# EasyEDA schematic 6502-debugProbe.json
TITLE: Probe; REV: 1.0; Date: 2023-04-01; Sheet: 1/1; Drawn By: devramsean0; Company: Your Company
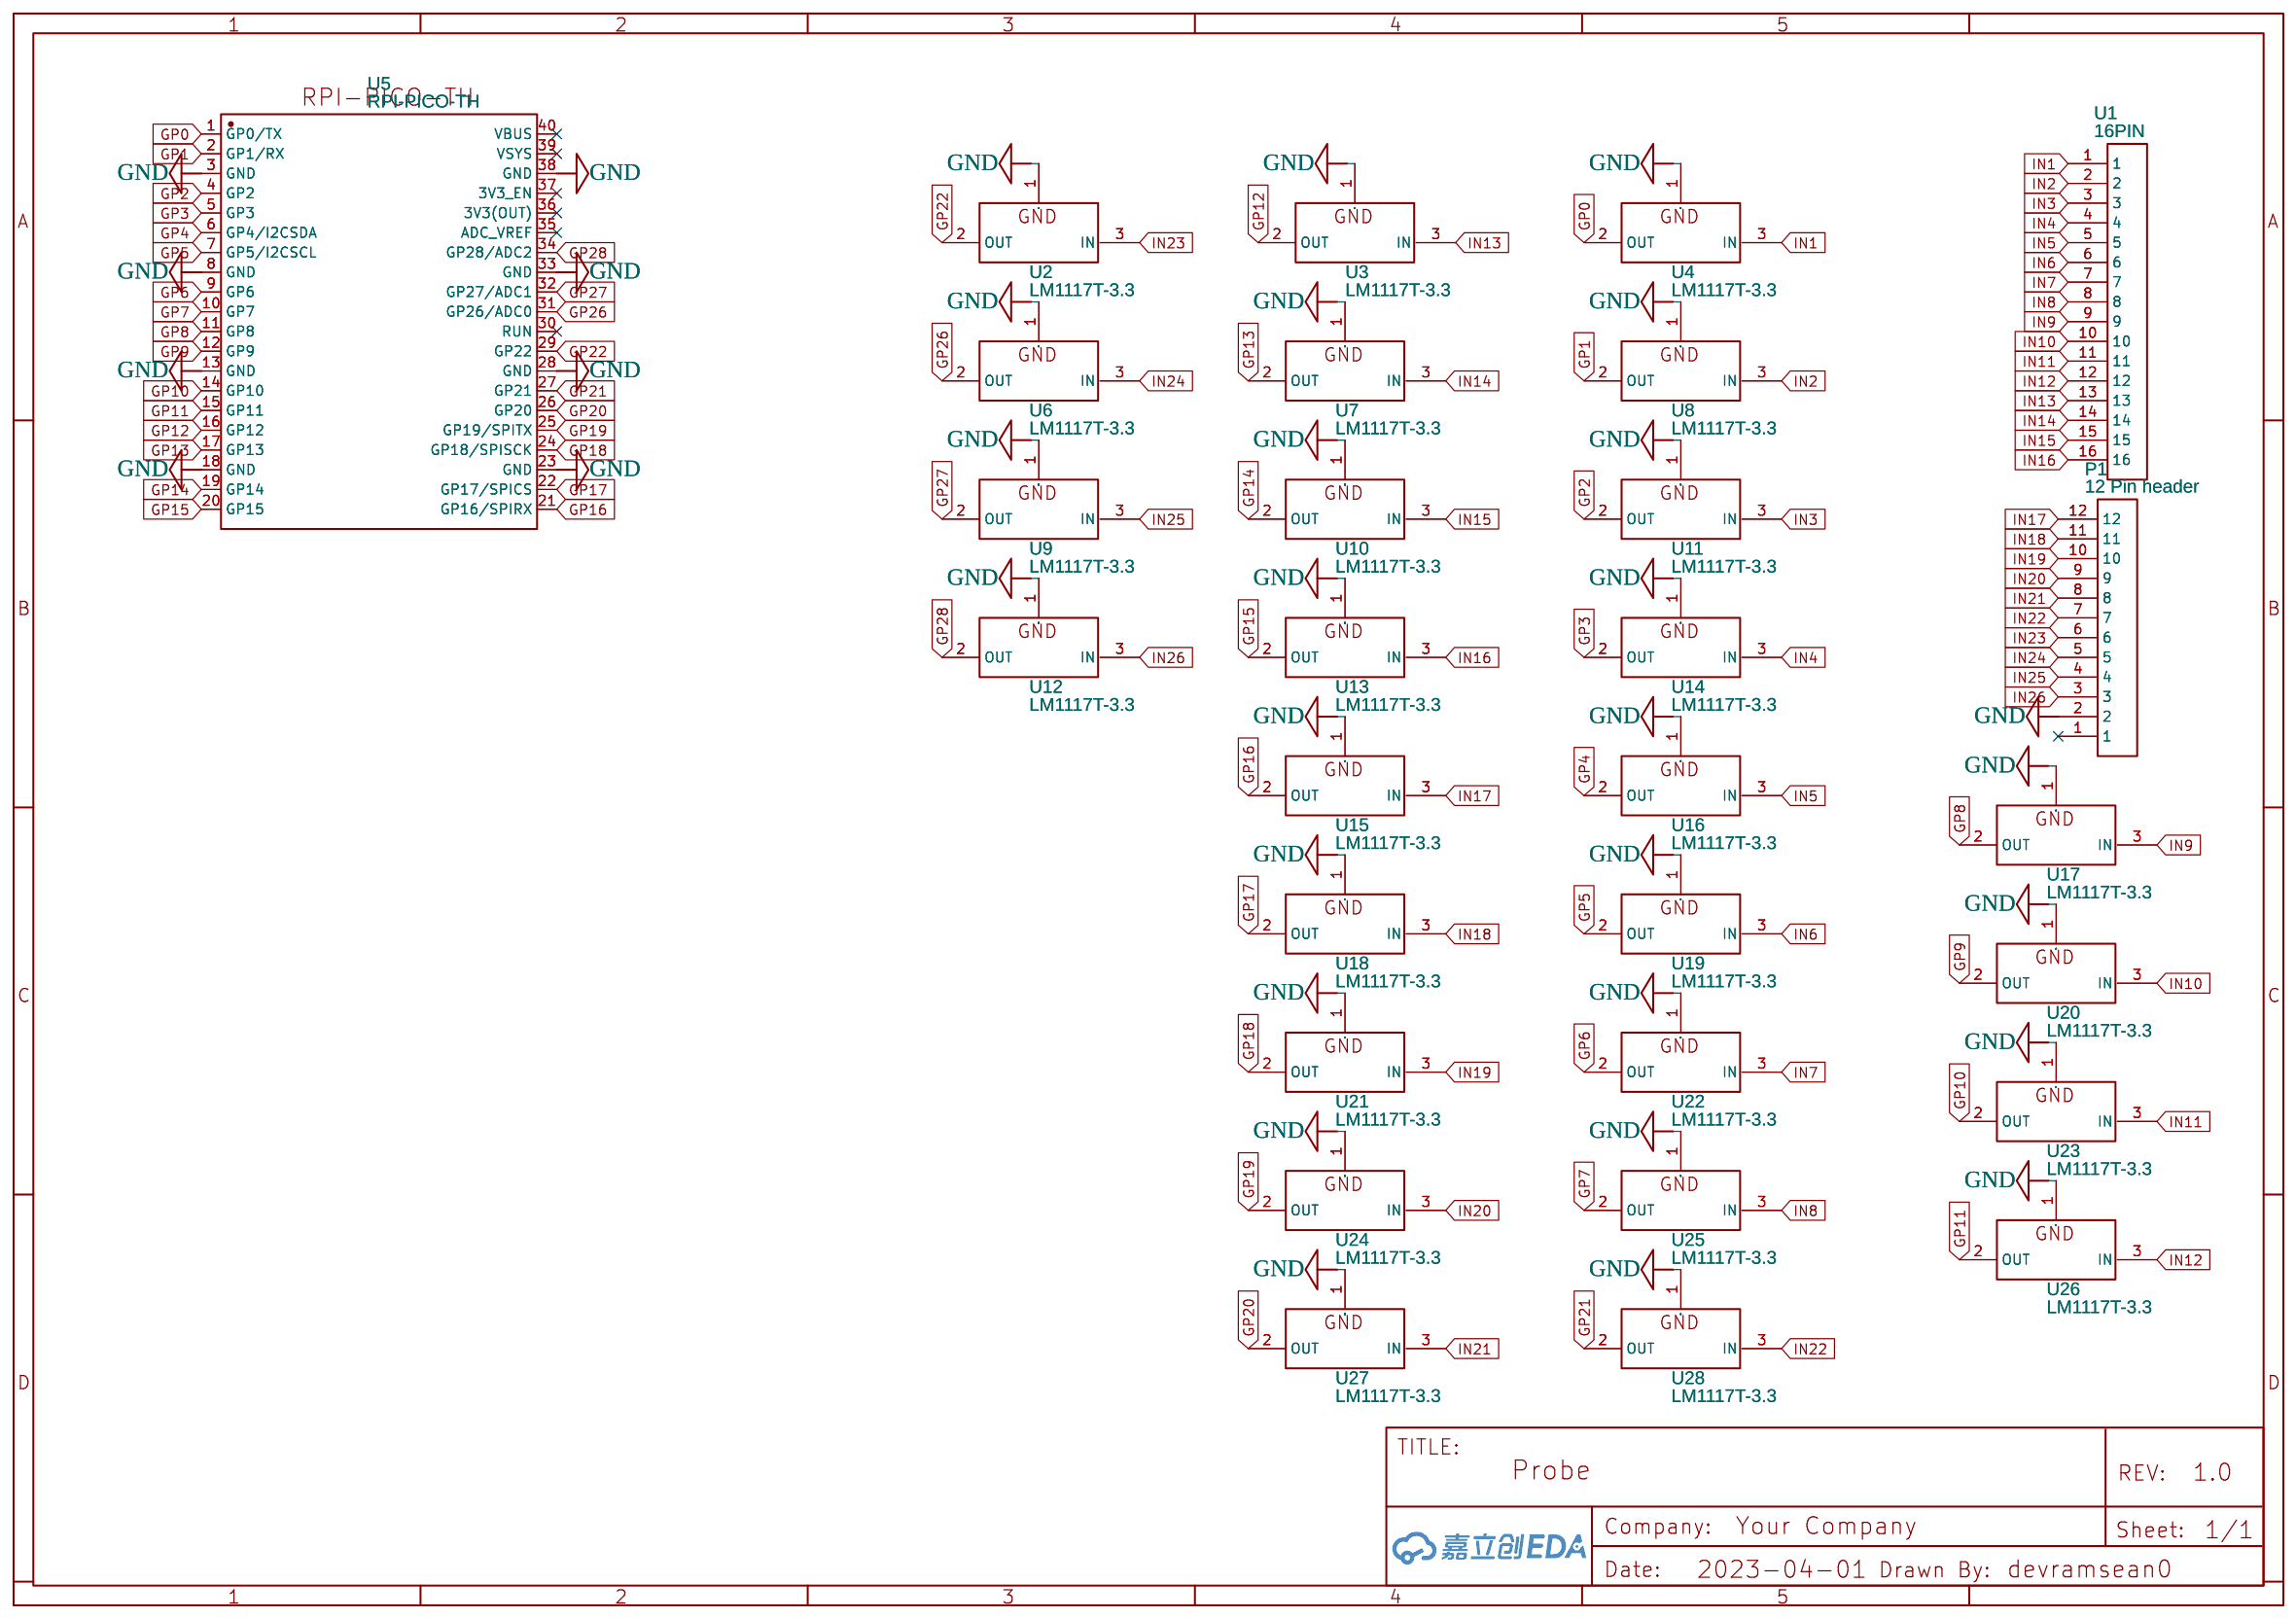
[diagram p0: schematic sheet]

## Parts
P1  12 Pin header  [12PINHEADER]
U1  16PIN  [16PIN]
U2  LM1117T-3.3  [TO-220-3_L10.0-W4.5-P2.54-L]
U3  LM1117T-3.3  [TO-220-3_L10.0-W4.5-P2.54-L]
U4  LM1117T-3.3  [TO-220-3_L10.0-W4.5-P2.54-L]
U5  RPI-PICO-TH  [RPI-PICO-TH]
U6  LM1117T-3.3  [TO-220-3_L10.0-W4.5-P2.54-L]
U7  LM1117T-3.3  [TO-220-3_L10.0-W4.5-P2.54-L]
U8  LM1117T-3.3  [TO-220-3_L10.0-W4.5-P2.54-L]
U9  LM1117T-3.3  [TO-220-3_L10.0-W4.5-P2.54-L]
U10  LM1117T-3.3  [TO-220-3_L10.0-W4.5-P2.54-L]
U11  LM1117T-3.3  [TO-220-3_L10.0-W4.5-P2.54-L]
U12  LM1117T-3.3  [TO-220-3_L10.0-W4.5-P2.54-L]
U13  LM1117T-3.3  [TO-220-3_L10.0-W4.5-P2.54-L]
U14  LM1117T-3.3  [TO-220-3_L10.0-W4.5-P2.54-L]
U15  LM1117T-3.3  [TO-220-3_L10.0-W4.5-P2.54-L]
U16  LM1117T-3.3  [TO-220-3_L10.0-W4.5-P2.54-L]
U17  LM1117T-3.3  [TO-220-3_L10.0-W4.5-P2.54-L]
U18  LM1117T-3.3  [TO-220-3_L10.0-W4.5-P2.54-L]
U19  LM1117T-3.3  [TO-220-3_L10.0-W4.5-P2.54-L]
U20  LM1117T-3.3  [TO-220-3_L10.0-W4.5-P2.54-L]
U21  LM1117T-3.3  [TO-220-3_L10.0-W4.5-P2.54-L]
U22  LM1117T-3.3  [TO-220-3_L10.0-W4.5-P2.54-L]
U23  LM1117T-3.3  [TO-220-3_L10.0-W4.5-P2.54-L]
U24  LM1117T-3.3  [TO-220-3_L10.0-W4.5-P2.54-L]
U25  LM1117T-3.3  [TO-220-3_L10.0-W4.5-P2.54-L]
U26  LM1117T-3.3  [TO-220-3_L10.0-W4.5-P2.54-L]
U27  LM1117T-3.3  [TO-220-3_L10.0-W4.5-P2.54-L]
U28  LM1117T-3.3  [TO-220-3_L10.0-W4.5-P2.54-L]

## Library data of the parts
P1 = 12 Pin header: Contributor: stefanfransen16
U1 = 16PIN: Contributor: Ostap Ostap
U2-U4 U6-U28 = LM1117T-3.3: Supplier: LCSC; Supplier Part: C498321; Manufacturer: HGSEMI; Contributor: LCSC; JLCPCB Part Class: Extended Part
U5 = RPI-PICO-TH: Manufacturer: Raspberry Pi; Manufacturer Part: RP2040; Contributor: Dddienst

## Nets
GND: P1.2 U2.1(GND) U3.1(GND) U4.1(GND) U5.3(GND) U5.8(GND) U5.13(GND) U5.18(GND) U5.23(GND) U5.28(GND) U5.33(GND) U5.38(GND) U6.1(GND) U7.1(GND) U8.1(GND) U9.1(GND) U10.1(GND) U11.1(GND) U12.1(GND) U13.1(GND) U14.1(GND) U15.1(GND) U16.1(GND) U17.1(GND) U18.1(GND) U19.1(GND) U20.1(GND) U21.1(GND) U22.1(GND) U23.1(GND) U24.1(GND) U25.1(GND) U26.1(GND) U27.1(GND) U28.1(GND)
GP0: U4.2(OUT) U5.1(GP0/TX)
GP1: U5.2(GP1/RX) U8.2(OUT)
GP2: U5.4(GP2) U11.2(OUT)
GP3: U5.5(GP3) U14.2(OUT)
GP4: U5.6(GP4/I2CSDA) U16.2(OUT)
GP5: U5.7(GP5/I2CSCL) U19.2(OUT)
GP6: U5.9(GP6) U22.2(OUT)
GP7: U5.10(GP7) U25.2(OUT)
GP8: U5.11(GP8) U17.2(OUT)
GP9: U5.12(GP9) U20.2(OUT)
GP10: U5.14(GP10) U23.2(OUT)
GP11: U5.15(GP11) U26.2(OUT)
GP12: U3.2(OUT) U5.16(GP12)
GP13: U5.17(GP13) U7.2(OUT)
GP14: U5.19(GP14) U10.2(OUT)
GP15: U5.20(GP15) U13.2(OUT)
GP16: U5.21(GP16/SPIRX) U15.2(OUT)
GP17: U5.22(GP17/SPICS) U18.2(OUT)
GP18: U5.24(GP18/SPISCK) U21.2(OUT)
GP19: U5.25(GP19/SPITX) U24.2(OUT)
GP20: U5.26(GP20) U27.2(OUT)
GP21: U5.27(GP21) U28.2(OUT)
GP22: U2.2(OUT) U5.29(GP22)
GP26: U5.31(GP26/ADC0) U6.2(OUT)
GP27: U5.32(GP27/ADC1) U9.2(OUT)
GP28: U5.34(GP28/ADC2) U12.2(OUT)
IN1: U1.1 U4.3(IN)
IN2: U1.2 U8.3(IN)
IN3: U1.3 U11.3(IN)
IN4: U1.4 U14.3(IN)
IN5: U1.5 U16.3(IN)
IN6: U1.6 U19.3(IN)
IN7: U1.7 U22.3(IN)
IN8: U1.8 U25.3(IN)
IN9: U1.9 U17.3(IN)
IN10: U1.10 U20.3(IN)
IN11: U1.11 U23.3(IN)
IN12: U1.12 U26.3(IN)
IN13: U1.13 U3.3(IN)
IN14: U1.14 U7.3(IN)
IN15: U1.15 U10.3(IN)
IN16: U1.16 U13.3(IN)
IN17: P1.12 U15.3(IN)
IN18: P1.11 U18.3(IN)
IN19: P1.10 U21.3(IN)
IN20: P1.9 U24.3(IN)
IN21: P1.8 U27.3(IN)
IN22: P1.7 U28.3(IN)
IN23: P1.6 U2.3(IN)
IN24: P1.5 U6.3(IN)
IN25: P1.4 U9.3(IN)
IN26: P1.3 U12.3(IN)

Not connected (* = marked no-connect by the designer): P1 1*; U5 30(RUN)* 35(ADC_VREF)* 36(3V3(OUT))* 37(3V3_EN)* 39(VSYS)* 40(VBUS)*
